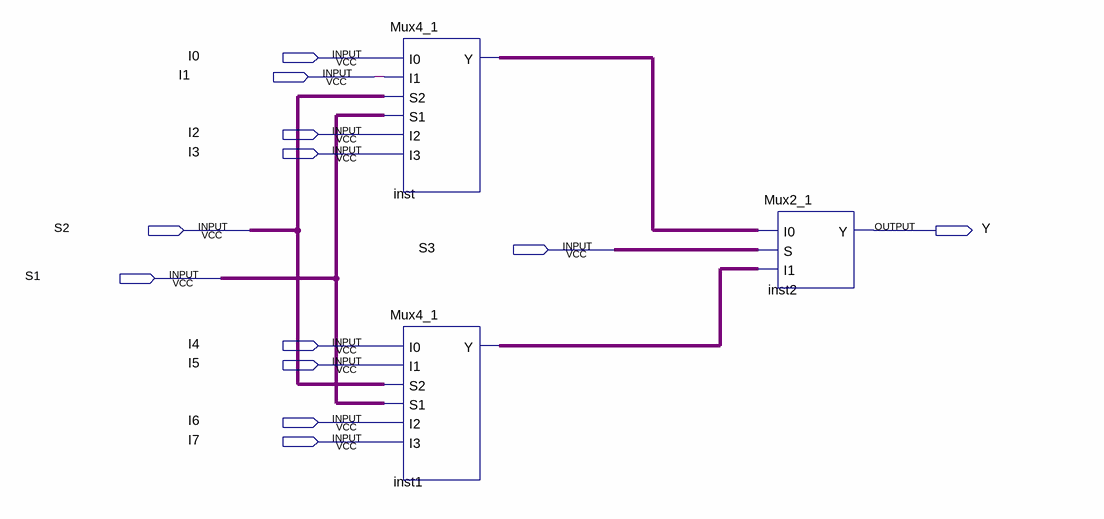
[diagram p0: schematic sheet]
// Quartus schematic Mux8_1.bdf as structural Verilog: 3 symbols, 12 pins
module Mux8_1 (
  input  I0,
  input  I1,
  input  I2,
  input  I3,
  input  S2,
  input  S3,
  input  S1,
  input  I4,
  input  I5,
  input  I6,
  input  I7,
  output Y
);

  wire inst1_y, inst_y;

  Mux4_1 inst (.I0(I0), .I1(I1), .S2(S2), .S1(S1), .I2(I2), .I3(I3), .Y(inst_y));
  Mux4_1 inst1 (.I0(I4), .I1(I5), .S2(S2), .S1(S1), .I2(I6), .I3(I7), .Y(inst1_y));
  Mux2_1 inst2 (.I0(inst_y), .S(S3), .I1(inst1_y), .Y(Y));
endmodule
